# EAGLE schematic v001 (EAGLE 6.4)
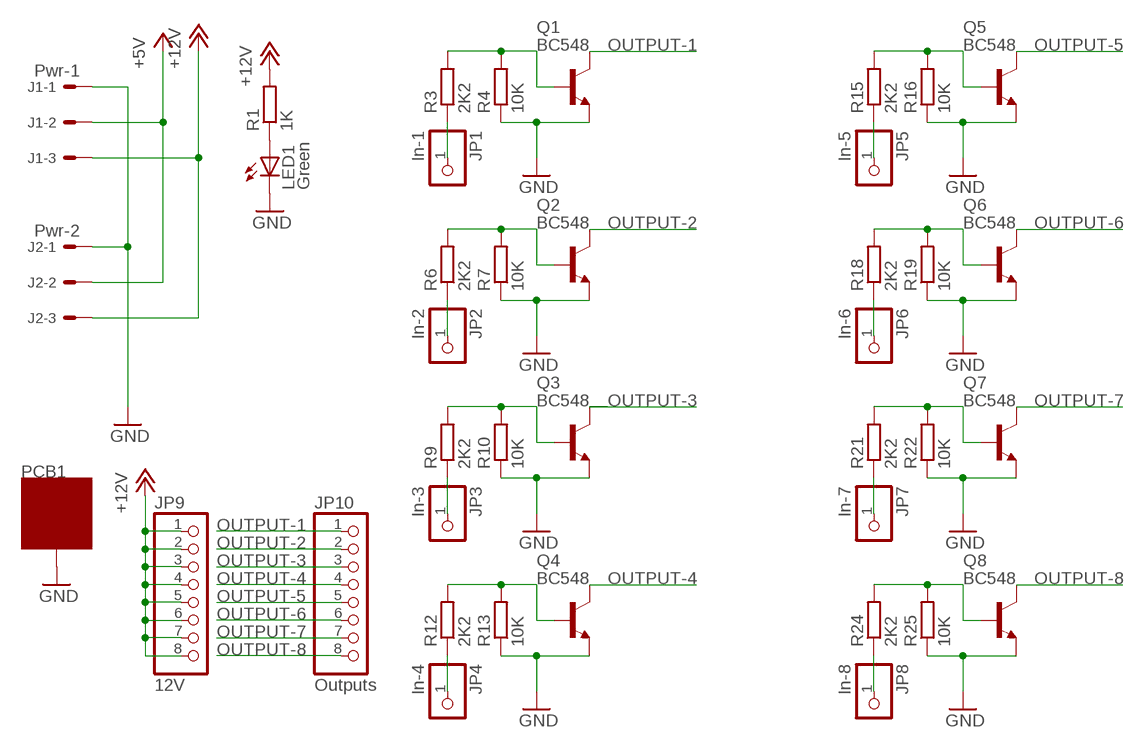
[diagram p0: schematic, sheet 1]

## Parts
J1  Pwr-1  22-27-2031-03  [6410-03]
J2  Pwr-2  22-27-2031-03  [6410-03]
JP1  In-1  PINHD-1X1  [1X01]
JP2  In-2  PINHD-1X1  [1X01]
JP3  In-3  PINHD-1X1  [1X01]
JP4  In-4  PINHD-1X1  [1X01]
JP5  In-5  PINHD-1X1  [1X01]
JP6  In-6  PINHD-1X1  [1X01]
JP7  In-7  PINHD-1X1  [1X01]
JP8  In-8  PINHD-1X1  [1X01]
JP9  12V  PINHD-1X8  [1X08]
JP10  Outputs  PINHD-1X8  [1X08]
LED1  Green  LED3MM  [LED3MM]
PCB1  ZZZ_MODULE05X05  [ZZZ_MODULE_05X05]
Q1  BC548  [TO92-EBC]
Q2  BC548  [TO92-EBC]
Q3  BC548  [TO92-EBC]
Q4  BC548  [TO92-EBC]
Q5  BC548  [TO92-EBC]
Q6  BC548  [TO92-EBC]
Q7  BC548  [TO92-EBC]
Q8  BC548  [TO92-EBC]
R1  1K  R-EU_0207/2V  [0207/2V]
R3  2K2  R-EU_0204/7  [0204/7]
R4  10K  R-EU_0207/2V  [0207/2V]
R6  2K2  R-EU_0204/7  [0204/7]
R7  10K  R-EU_0207/2V  [0207/2V]
R9  2K2  R-EU_0204/7  [0204/7]
R10  10K  R-EU_0207/2V  [0207/2V]
R12  2K2  R-EU_0204/7  [0204/7]
R13  10K  R-EU_0207/2V  [0207/2V]
R15  2K2  R-EU_0204/7  [0204/7]
R16  10K  R-EU_0207/2V  [0207/2V]
R18  2K2  R-EU_0204/7  [0204/7]
R19  10K  R-EU_0207/2V  [0207/2V]
R21  2K2  R-EU_0204/7  [0204/7]
R22  10K  R-EU_0207/2V  [0207/2V]
R24  2K2  R-EU_0204/7  [0204/7]
R25  10K  R-EU_0207/2V  [0207/2V]

## Nets
+5V: J1.2 J2.2
+12V: J1.3 J2.3 JP9.1 JP9.2 JP9.3 JP9.4 JP9.5 JP9.6 JP9.7 JP9.8 R1.2
GND: J1.1 J2.1 LED1.K(C) PCB1.GND@1(GND) PCB1.GND@2(GND) PCB1.GND@3(GND) PCB1.GND@4(GND) PCB1.GND@5(GND) PCB1.GND@6(GND) PCB1.GND@7(GND) PCB1.GND@8(GND) Q1.E Q2.E Q3.E Q4.E Q5.E Q6.E Q7.E Q8.E R4.1 R7.1 R10.1 R13.1 R16.1 R19.1 R22.1 R25.1
N$1: LED1.A R1.1
N$2: Q2.B R6.2 R7.2
N$3: JP2.1 R6.1
N$5: Q3.B R9.2 R10.2
N$6: JP3.1 R9.1
N$8: Q4.B R12.2 R13.2
N$9: JP4.1 R12.1
N$11: Q5.B R15.2 R16.2
N$12: JP5.1 R15.1
N$14: Q1.B R3.2 R4.2
N$15: JP1.1 R3.1
N$16: Q6.B R18.2 R19.2
N$17: JP6.1 R18.1
N$19: Q7.B R21.2 R22.2
N$20: JP7.1 R21.1
N$22: Q8.B R24.2 R25.2
N$23: JP8.1 R24.1
OUTPUT-1: JP10.1 Q1.C
OUTPUT-2: JP10.2 Q2.C
OUTPUT-3: JP10.3 Q3.C
OUTPUT-4: JP10.4 Q4.C
OUTPUT-5: JP10.5 Q5.C
OUTPUT-6: JP10.6 Q6.C
OUTPUT-7: JP10.7 Q7.C
OUTPUT-8: JP10.8 Q8.C

## Library data of the parts
J1 J2 = con-molex:22-?-03: CONNECTOR wire to board 2.54 mm (.1 inch) pitch header; OC_FARNELL: unknown; OC_NEWARK: unknown
JP1-JP8 = pinhead:PINHD-1X1: PIN HEADER
JP9 JP10 = pinhead:PINHD-1X8: PIN HEADER
LED1 = led:LED: LED OSRAM: - CHIPLED LG R971, LG N971, LY N971, LG Q971, LY Q971, LO R971, LY R971 LH N974, LH R974 LS Q976, LO Q976, LY Q976 LO Q996 - Hyper CHIPLED LW Q18S LB Q993, LB Q99A, LB R99A - SideLED LS A670, LO A670, LY A670, LG A670, LP A670 LB A673, LV A673, LT A673, LW A673 LH A674 LY A675 LS A676, LA A676, LO A676, LY A676, LW A676 LS A679, LY A679, LG A679 - Hyper Micro SIDELED® LS Y876, LA Y876, LO Y876, LY Y876 LT Y87S - SmartLED LW L88C, LW L88S LB L89C, LB L89S, LG L890 LS L89K, LO L89K, LY L89K LS L896, LA L896, LO L896, LY L896 - TOPLED LS T670, LO T670, LY T670, LG T670, LP T670 LSG T670, LSP T670, LSY T670, LOP T670, LYG T670 LG T671, LOG T671, LSG T671 LB T673, LV T673, LT T673, LW T673 LH T674 LS T676, LA T676, LO T676, LY T676, LB T676, LH T676, LSB T676, LW T676 LB T67C, LV T67C, LT T67C, LS T67K, LO T67K, LY T67K, LW E67C LS E67B, LA E67B, LO E67B, LY E67B, LB E67C, LV E67C, LT E67C LW T67C LS T679, LY T679, LG T679 LS T770, LO T770, LY T770, LG T770, LP T770 LB T773, LV T773, LT T773, LW T773 LH T774 LS E675, LA E675, LY E675, LS T675 LS T776, LA T776, LO T776, LY T776, LB T776 LHGB T686 LT T68C, LB T68C - Hyper Mini TOPLED® LB M676 - Mini TOPLED Santana® LG M470 LS M47K, LO M47K, LY M47K Source: http://www.osram.convergy.de LUXEON: - LUMILED® LXK2-PW12-R00, LXK2-PW12-S00, LXK2-PW14-U00, LXK2-PW14-V00 LXK2-PM12-R00, LXK2-PM12-S00, LXK2-PM14-U00 LXK2-PE12-Q00, LXK2-PE12-R00, LXK2-PE12-S00, LXK2-PE14-T00, LXK2-PE14-U00 LXK2-PB12-K00, LXK2-PB12-L00, LXK2-PB12-M00, LXK2-PB14-N00, LXK2-PB14-P00, LXK2-PB14-Q00 LXK2-PR12-L00, LXK2-PR12-M00, LXK2-PR14-Q00, LXK2-PR14-R00 LXK2-PD12-Q00, LXK2-PD12-R00, LXK2-PD12-S00 LXK2-PH12-R00, LXK2-PH12-S00 LXK2-PL12-P00, LXK2-PL12-Q00, LXK2-PL12-R00 Source: www.luxeon.com KINGBRIGHT: KA-3528ASYC Source: www.kingbright.com
PCB1 = GNLib:ZZZ_MODULE
Q1-Q8 = transistor-npn:BC548*: NPN Transistor
R1 R4 R7 R10 R13 R16 R19 R22 R25 = resistor:R-EU_: RESISTOR, European symbol
R3 R6 R9 R12 R15 R18 R21 R24 = rcl:R-EU_: RESISTOR, European symbol